# Altium schematic sheet Emitter.SchDoc: Sensor Module - Emitter
size A4; CompanyName: UofT Capstone Team 2024991; Revision: 1; SheetNumber: 2; SheetTotal: 3
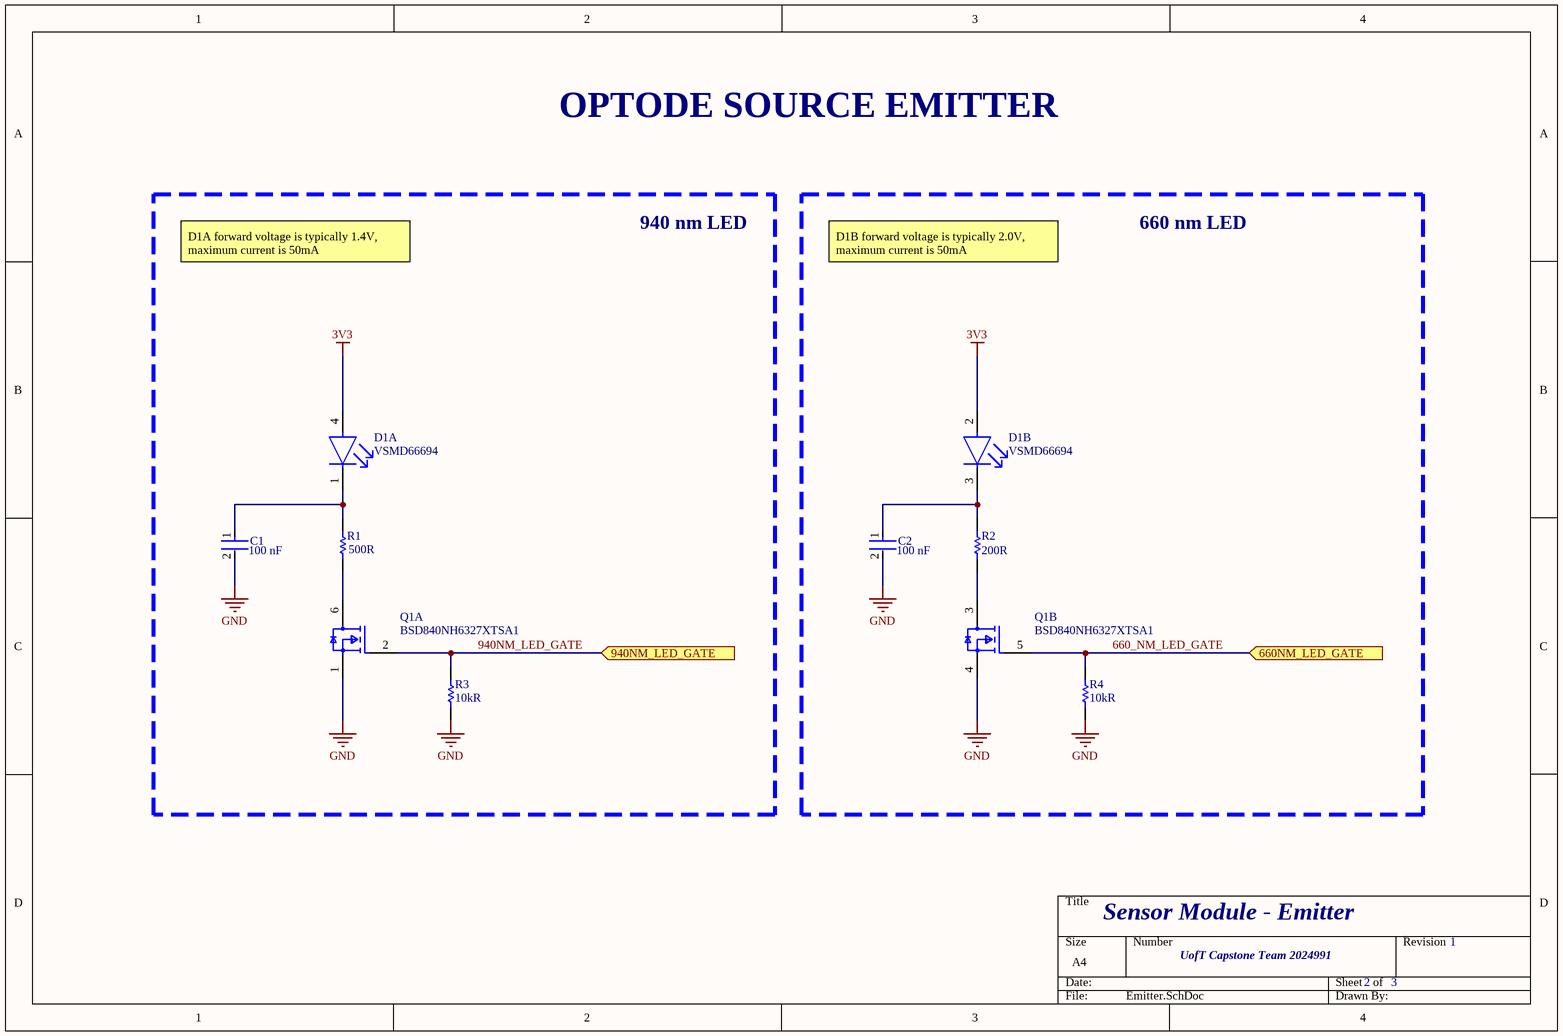
[diagram p0: Emitter.SchDoc]

## Parts
C1  Capacitance: 100 nF  [FP-CC0603-DA-MFG]  (hidden comment: CC0603KRX7R7BB104)
C2  Capacitance: 100 nF  [FP-CC0603-DA-MFG]  (hidden comment: CC0603KRX7R7BB104)
D1  VSMD66694  [FP-6_550-5347_01-4-MFG]  (parts A,B of 2)
Q1  BSD840NH6327XTSA1  [FP-PG-SOT363-6-MFG]  (parts A,B of 2)
R1  RK73H1JTTD38R3F  [RESC1608X55X30LL20T10]  (value not drawn)
R2  Resistance: 200R  [RESC1609X50X30NL10T20]  (hidden comment: CRCW0603200RJNEA)
R3  Resistance: 10kR  [RESC1609X50X30NL8T20]  (hidden comment: CRCW060310K0FKEA)
R4  Resistance: 10kR  [RESC1609X50X30NL8T20]  (hidden comment: CRCW060310K0FKEA)

## Blocks framed on the sheet
940 nm LED: C1 D1 Q1 R1 R3
660 nm LED: C2 D1 Q1 R2 R4

## Ports
660NM_LED_GATE (in, see Top[2C]), 940NM_LED_GATE (in, see Top[2C])

## Nets
3V3: D1.2(RED_A) D1.4(IR_anode)
GND: C1.2 C2.2 Q1.1(1_SOURCE) Q1.4(2_SOURCE) R3.1 R4.1
660_NM_LED_GATE: Q1.5(2_GATE) R4.2 ; port 660NM_LED_GATE
940NM_LED_GATE: Q1.2(1_GATE) R3.2 ; port 940NM_LED_GATE
NetC1_1: C1.1 D1.1(IR_cathode) R1.2
NetC2_1: C2.1 D1.3(RED_C) R2.2
NetQ1_3: Q1.3(2_DRAIN) R2.1
NetQ1_6: Q1.6(1_DRAIN) R1.1

## Notes on the sheet
- OPTODE SOURCE EMITTER
- D1A forward voltage is typically 1.4V, maximum current is 50mA
- D1B forward voltage is typically 2.0V, maximum current is 50mA
- (near R1) 500R

## Library data of the parts
C1 C2 = CMP-2000-05002-2: CAP CER 0.1UF 16V X7R 0603; Manufacturer: YAGEO; Tolerance: 0.1; Value: 100 nF; Temperature Coefficient: 15%; Material: Ceramic; Voltage Rating: 16 V; Package: CC0603-DA; ComponentLink2Description: Datasheet; Octopart: https://octopart.com/cc0603krx7r7bb104-yageo-192941; Temperature Range High: +125°C; Digikey Description: CAP CER 0.1UF 16V X7R 0603; Voltage: 16 V; Device Class L2: Capacitors; Height: 0.9mm; Temperature: -55°C to +125°C; Manufacturer Part Number: CC0603KRX7R7BB104; Device Class L1: Passive Components; Device Class L3: Ceramic Capacitors; ComponentLink2URL: http://www.yageo.com/documents/recent/UPY-GPHC_X7R_6.3V-to-50V_18.pdf; Footprint Url: http://www.yageo.com/exep/pages/download/literatures/UPY-C_GEN_24.pdf; RoHS: TRUE; Temperature Range Low: -55°C; Temperature Characteristic: X7R; Lead Free: Yes; Category: Cap; Mouser Description: Multilayer Ceramic Capacitor, CC Series, 0.1 - F, - 10%, X7R, 16 V, 0603 [1608 Metric]; Automotive: No
D1 = CMP-02520-000014-1: EMITTER DUAL 660/940NM SQURE PCB; Manufacturer: Vishay Semiconductor Opto Division; Forward Voltage: 2/1.4V; Viewing Angle: 120°; Colour: Red,IR; Led Orientation: Top View; Forward Current: 20mA; Power Dissipation: 161/119mW; Reverse Voltage: 5V; Max Junction Temp: +100°C; Digikey Description: EMITTER DUAL 660/940NM SQURE PCB; ComponentLink2Description: Datasheet; Temperature Range Low: -25°C; Package: 6.550-5347.01-4; Ambient Temperature Range Low: -25°C; Category: Diode; Temperature: -25°C to +85°C; Device Class L3: unset; Ambient Temperature Range High: +85°C; Temperature Range High: +85°C; Automotive: No; Height: 0.97mm; Lead Free: Yes; Peak Emmision Wavelength: 660/940nm; Device Class L2: LEDs; RoHS: TRUE; Octopart: https://octopart.com/vsmd66694-vishay-74221794; Manufacturer Part Number: VSMD66694; Device Class L1: Optoelectronics; ComponentLink2URL: https://www.vishay.com/docs/84324/vsmd66694.pdf
Q1 = CMP-32901-000170-1: MOSFET 2N-CH 20V 0.88A SOT363; Input Capacitance: 78pF; Rds On Max: 400mR; Max Power Dissipation: 500mW; Rise Time: 2.2ns; FET Type: 2 N-Channel; Continuous Drain Current (ID): 880mA; Gate to Source Voltage (Vgs): 8V; Halogen Free: Halogen Free; Case/Package: SOT-363-6; Mount: Surface Mount; Packaging: Tape and Reel; Lead Free: Lead Free; Max Operating Temperature: 150°C; Number of Pins: 6; Max Dual Supply Voltage: 20V; Drain to Source Voltage (Vdss): 20V; Min Operating Temperature: -55°C
R1 = CMP-2000-01468-1: Manufacturer: KOA Speer; Resistance: 38.3 Ohm; Part Number: RK73H1JTTD38R3F
R2 = CMP-2000-03064-1: Manufacturer: Vishay Dale; Part Number: CRCW0603200RJNEA
R3 R4 = CMP-1666-00005-4: Chip Resistor, 10 KOhm, +/- 1%, 100 mW, -55 to 155 degC, 0603 (1608 Metric), RoHS, Tape and Reel; Manufacturer: Vishay Semiconductor; Voltage Rating: 75 V; Max Operating Temperature: 155 degC; PackageDescription: 2-Pin Surface Mount Device, Body 1.575 x 0.85 mm; ComponentLink1Description: Manufacturer URL; RoHSCompliant: true; PackageReference: 0603; REACH SVHC: Unknown; Length: 1.55 mm; DatasheetVersion: 06/2012; Packaging: Tape and Reel; Min Operating Temperature: -55 degC; Mounting Technology: Surface Mount; ComponentLink2URL: https://datasheet.ciiva.com/11809/0900766b80d98afc-11809037.pdf; Height: 0.45 mm; ComponentLink2Description: Datasheet; Package Quantity: 5000; ComponentLink1URL: http://www.vishay.com/